# Altium schematic sheet 03_CONNECTORS_V1-0.SchDoc: RPi GS CAM SER.
size A3; Date: 2023-05-29; Author: M. Weimann; Organization: Altium Limited; Revision: 1.0; SheetNumber: 4; SheetTotal: 5; Title_Subtitle: Connectors; Language: DE; Department: F&E; Filename: RPi-GS-CAM-SER_PCB_V1-0.PDF; Project: PI-0017; DocType: Stromlauf; ItemNo-PCB: n/a
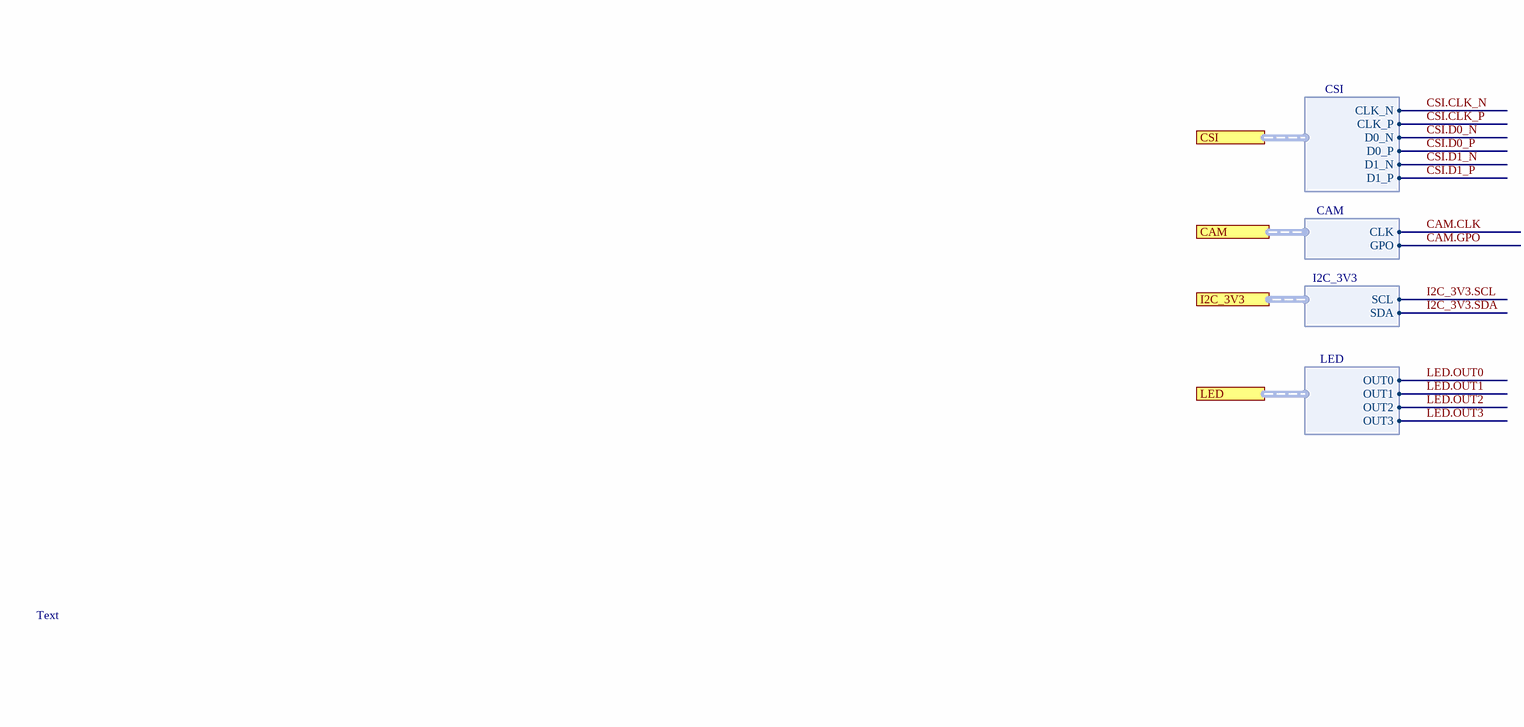
[diagram p0: 03_CONNECTORS_V1-0.SchDoc, left]
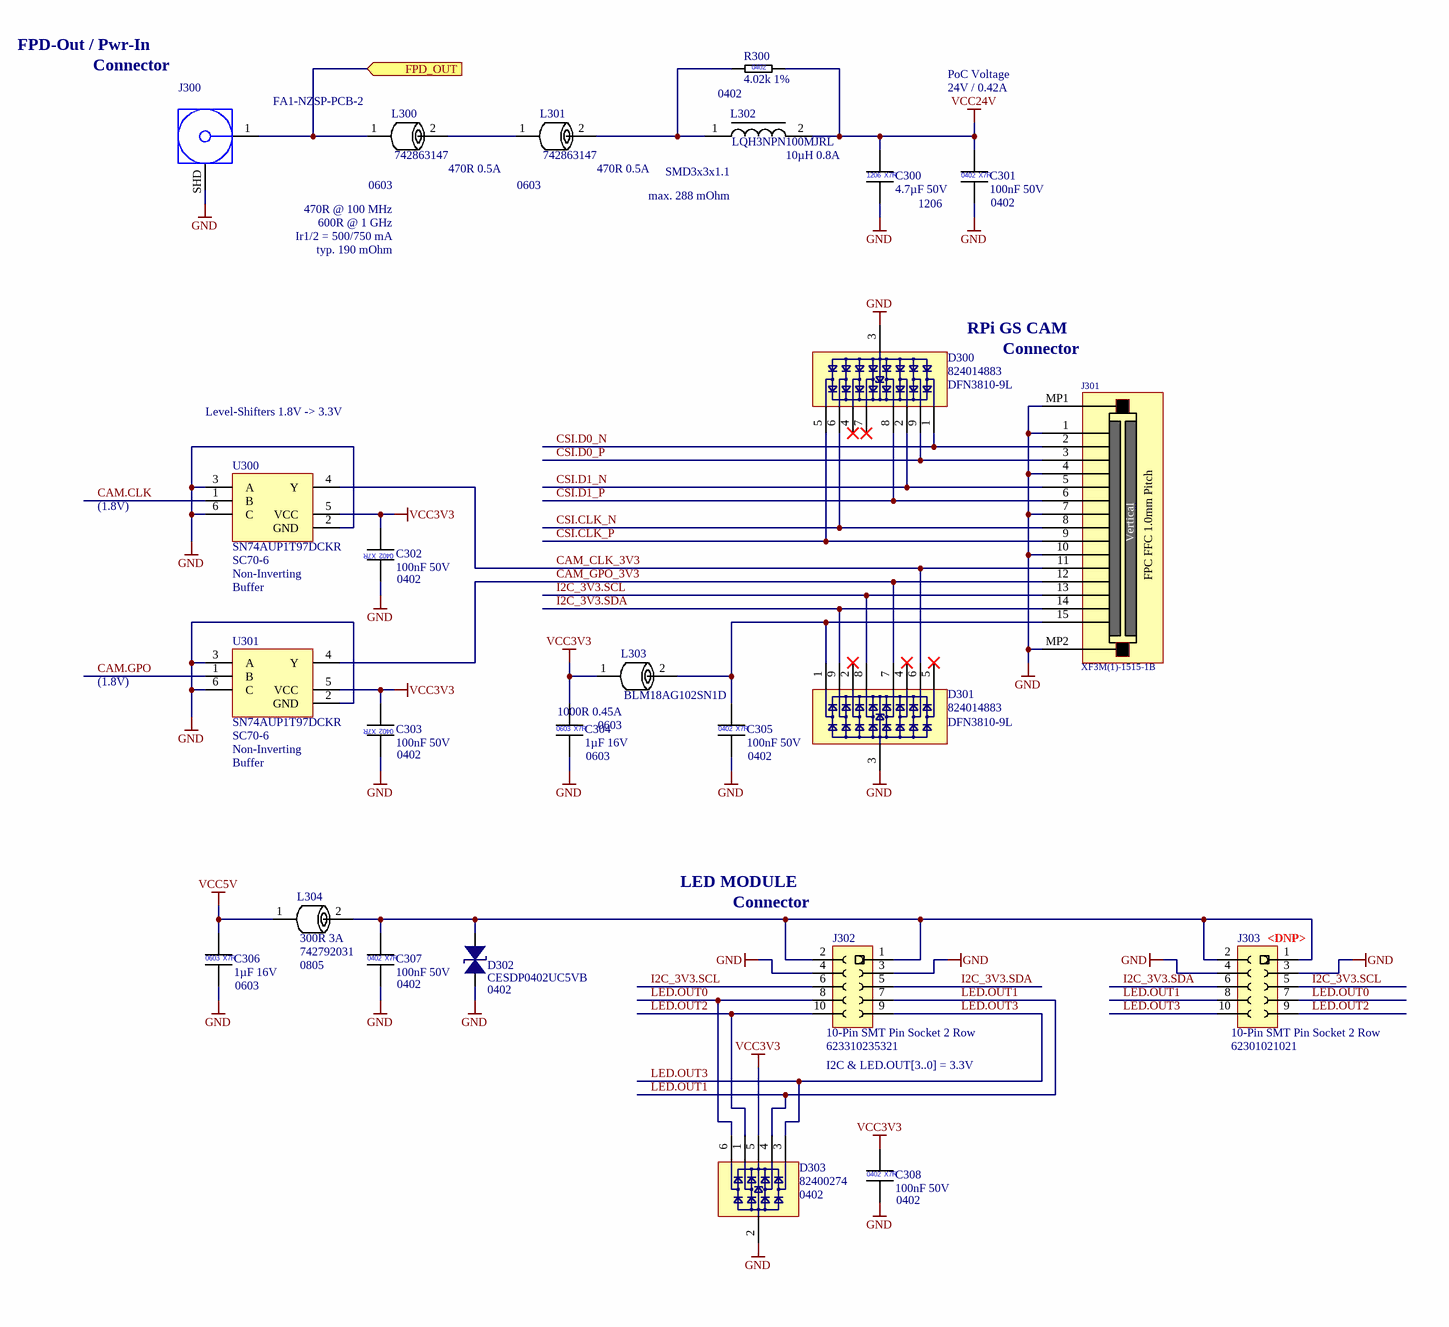
[diagram p1: 03_CONNECTORS_V1-0.SchDoc, right]

## Parts
C300  4.7µF 50V  [CAP_1206]
C301  100nF 50V  [CAP_0402_L]
C302  100nF 50V  [CAP_0402_L]
C303  100nF 50V  [CAP_0402_L]
C304  1µF 16V  [CAP_0603_L]
C305  100nF 50V  [CAP_0402_L]
C306  1µF 16V  [CAP_0603_L]
C307  100nF 50V  [CAP_0402_L]
C308  100nF 50V  [CAP_0402_L]
D300  824014883  [WE-TVS-DFN3810-9L]
D301  824014883  [WE-TVS-DFN3810-9L]
D302  CESDP0402UC5VB  [TVS_0402]  (value not drawn)
D303  82400274  [SOT65P210X100-6N]
J300  FA1-NZSP-PCB-2  [FA1-NZSP-PCB-2]  (value not drawn)
J301  XF3M(1)-1515-1B  [XF3M(1)-1515-1B]
J302  10-Pin SMT Pin Socket 2 Row  [623310235321]
J303  10-Pin SMT Pin Socket 2 Row  [62301021021]  (no BOM)
L300  742863147  [L_0603]
L301  742863147  [L_0603]
L302  LQH3NPN100MJRL  [LQH3NPN100MJRL]
L303  BLM18AG102SN1D  [L_0603]
L304  742792031  [L_0805]
R300  4.02k 1%  [RES_0402_L]
U300  SN74AUP1T97DCKR  [SOT65P210X100-6N]
U301  SN74AUP1T97DCKR  [SOT65P210X100-6N]

## Ports
CAM (harness CAM, see 00_RPi-GS-CAM-SER_V1-0[5B], 01_SERIALIZER_V1-0[7A]), CSI (harness CSI, see 00_RPi-GS-CAM-SER_V1-0[5B], 01_SERIALIZER_V1-0[7A]), FPD_OUT (in, see 00_RPi-GS-CAM-SER_V1-0[5B], 01_SERIALIZER_V1-0[7B]), I2C_3V3 (harness I2C_3V3, see 00_RPi-GS-CAM-SER_V1-0[5B], 02_I2C_V1-0[6A]), LED (harness LED, see 00_RPi-GS-CAM-SER_V1-0[5B], 02_I2C_V1-0[7C])

## Harnesses
I2C_3V3: SCL, SDA
LED: OUT0, OUT1, OUT2, OUT3
CSI: CLK_N, CLK_P, D0_N, D0_P, D1_P, D1_N
CAM: CLK, GPO

## Nets
GND: C300.2 C301.2 C302.1 C303.1 C304.2 C305.2 C306.2 C307.2 C308.2 D300.3(GND) D301.3(GND) D302.2 D303.2(GND) J300.SHD J301.1 J301.4 J301.7 J301.10 J301.MP1 J301.MP2 J302.3 J302.4 J303.3 J303.4 U300.2(GND) U300.3(A) U300.6(C) U301.2(GND) U301.3(A) U301.6(C)
VCC3V3: C302.2 C303.2 C304.1 C308.1 D303.5(VDD) L303.1 U300.5(VCC) U301.5(VCC)
VCC5V: C306.1 L304.1
VCC24V: C300.1 C301.1 L302.2 R300.2
CAM.CLK: U300.1(B) ; port CAM.CLK
CAM.GPO: U301.1(B) ; port CAM.GPO
CAM_CLK_3V3: D301.6(IO5) J301.11 U300.4(Y)
CAM_GPO_3V3: D301.7(IO6) J301.12 U301.4(Y)
CSI.CLK_N: D300.6(IO5) J301.8 ; port CSI.CLK_N
CSI.CLK_P: D300.5(IO4) J301.9 ; port CSI.CLK_P
CSI.D0_N: D300.1(IO1) J301.2 ; port CSI.D0_N
CSI.D0_P: D300.9(IO8) J301.3 ; port CSI.D0_P
CSI.D1_N: D300.2(IO2) J301.5 ; port CSI.D1_N
CSI.D1_P: D300.8(IO7) J301.6 ; port CSI.D1_P
FPD_OUT: J300.1(Signal) L300.1 ; port FPD_OUT
I2C_3V3.SCL: D301.8(IO7) J301.13 J302.6 J303.5 ; port I2C_3V3.SCL
I2C_3V3.SDA: D301.9(IO8) J301.14 J302.5 J303.6 ; port I2C_3V3.SDA
LED.OUT0: D303.6(IO4) J302.8 J303.7 ; port LED.OUT0
LED.OUT1: D303.4(IO3) J302.7 J303.8 ; port LED.OUT1
LED.OUT2: D303.1(IO1) J302.10 J303.9 ; port LED.OUT2
LED.OUT3: D303.3(IO2) J302.9 J303.10 ; port LED.OUT3
NetC305_1: C305.1 D301.1(IO1) J301.15 L303.2
NetC307_1: C307.1 D302.1 J302.1 J302.2 J303.1 J303.2 L304.2
NetL300_2: L300.2 L301.1
NetL301_2: L301.2 L302.1 R300.1

Not connected (* = marked no-connect by the designer): D300 4(IO3)* 7(IO6)*; D301 2(IO2)* 4(IO3)* 5(IO4)*

## Notes on the sheet
- FPD-Out / Pwr-In
- Connector
- (near R300) 0402
- PoC Voltage
- (near J300) FA1-NZSP-PCB-2
- 24V / 0.42A
- (near L300) 0603
- 470R @ 100 MHz
- (near L300) 470R 0.5A
- (near L301) 0603
- (near L301) 470R 0.5A
- (near L302) SMD3x3x1.1
- max. 288 mOhm
- (near L302) 10µH 0.8A
- (near C300) 1206
- (near C301) 0402
- Ir1/2 = 500/750 mA
- 600R @ 1 GHz
- typ. 190 mOhm
- RPi GS CAM
- Level-Shifters 1.8V -> 3.3V
- (near D300) DFN3810-9L
- (near J301) Connector
- (1.8V)
- (near U300) SC70-6
- (near U300) Non-Inverting
- Buffer
- (near C302) 0402
- (near U301) SC70-6
- (near U301) Non-Inverting
- (near C303) 0402
- 0603
- 1000R 0.45A
- (near D301) DFN3810-9L
- (near C304) 0603
- (near C305) 0402
- LED MODULE
- (near L304) 300R 3A
- (near J302) Connector
- (near J303) <DNP>
- Text
- (near C306) 0603
- 0805
- (near C307) 0402
- (near D302) CESDP0402UC5VB
- (near D302) 0402
- (near J302) 623310235321
- (near J302) I2C & LED.OUT[3..0] = 3.3V
- (near J303) 62301021021
- (near D303) 0402
- (near C308) 0402
- Erstellt von
- Dateiname
- ++CONFIDENTIAL++
- PCB Arts GmbH
- Dokumententyp
- Artikel-Nummer (PCB)
- Kurgartenstraße 59
- 90762 Fürth
- Elektronik- und Softwareentwicklung
- Titel, Sub-Titel
- Projekt
- Rev.
- Datum
- Sprache
- Seite
- The  information  contained  in  these  documents  is  confidential,  privileged  and  only  for  the
  information of the intended recipient and may
  not be used, published or redistributed without
  the prior written consent from PCB Arts GmbH.
- https://pcb-arts.com/
- mail@pcb-arts.com
- (in symbol CAP_0402_100nF_50V) 0402; X7R
- (in symbol CAP_0603_1µF_16V_X7R_10%) 0603; X7R
- (in symbol CAP_1206_4.7µF_50V_X7R_10%) 1206; X7R
- (in symbol RES_0402_4.02k_1%) 0402
- (in symbol XF3M(1)-1515-1B_15Pol FFC FPC Connector SMD) Vertical; FPC FFC 1.0mm Pitch

## Library data of the parts
C300 = CAP_1206_4.7µF_50V_X7R_10%: Multilayer Ceramic Capacitors MLCC - SMD/SMT 4.7 uF 50 VDC 10% 1206 X7R; Manufacturer 1: Murata Electronics; Manufacturer 1 Prt. Nr.: GRM31CR71H475KA12L; Manufacturer 2 Prt. Nr.: C1206X475K5RACAUTO; Manufacturer 2: Kemet
C301-C303 C305 C307 C308 = CAP_0402_100nF_50V: Multilayer Ceramic Capacitors MLCC - SMD/SMT 0402 50VDC; Manufacturer 1: Murata Electronics; Manufacturer 1 Prt. Nr.: GCM155L8EH104KE07D; Manufacturer 2 Prt. Nr.: UMK105B7104KV-FR; Manufacturer 2: TDK
C304 C306 = CAP_0603_1µF_16V_X7R_10%: Multilayer Ceramic Capacitors MLCC - SMD/SMT 0603 16VDC 1uF 10% X7R 0.8mm; Manufacturer 1: TDK; Manufacturer 1 Prt. Nr.: C1608X7R1C105K080AC; Manufacturer 2 Prt. Nr.: C0603C105K4RACTU; Manufacturer 2: KEMET
D300 D301 = 824014883_ESD-Suppressors_TVS-Diodes_3.3V_0.5pF_8Chnl: ESD Suppressors / TVS Diodes WE-TVS Diode Array 3.3V 0.5pF 8Channel; Manufacturer 1: Wurth Elektronik; Manufacturer 1 Prt. Nr.: 824014883
D302 = CESDP0402UC5VB_TVS Diode 0402: Low Capacitance ESD Protection Diode 0402; Manufacturer 1: CREATEK; Manufacturer 2 Prt. Nr.: BPESD0402-05ST; Manufacturer 1 Prt. Nr.: CESDP0402UC5VB; Manufacturer 2: BORN
D303 = 82400274_ESD-Suppressors_TVS-Diodes_5V_1.2pF_4Chnl: ESD Suppressors / TVS Diodes WE-TVS High Speed 5uA 5VDC 4+1; Manufacturer 1: Wurth Elektronik; Manufacturer 1 Prt. Nr.: 82400274
J300 = FA1-NZSP-PCB-2_FAKRA Key-Z Connector: FAKRA GEN 1 PCB Through Hole Straight Plug 50 Ohm Z Key Code; Manufacturer 1: Amphenol RF; Manufacturer 1 Prt. Nr.: FA1-NZSP-PCB-2
J301 = XF3M(1)-1515-1B_15Pol FFC FPC Connector SMD: 1.00mm Pitch RotaryBackLock FFC/FPC Connector, Surface Mount, Right-Angle,, Dual-Sided Contact Style, 15 Circuits; Manufacturer 1: Omron; Manufacturer 1 Prt. Nr.: XF3M(1)-1515-1B
J302 = 623310235321_WR-PHD_1.27mm_10Pin_SMT_Pin_Socket_2_Row_BottomEntry: Headers & Wire Housings WR-PHD 1.27mm SMT St SMT 10P 2Row H=2.2mm; Manufacturer 1: Wurth Elektronik; Manufacturer 1 Prt. Nr.: 623310235321
J303 = 62301021021_WR-PHD_1.27mm_10Pin_SMT_Pin_Socket_2_Row_TopEntry: Headers & Wire Housings WR-PHD 1.27 mm Dual SMT Socket Header H= 4.6mm; Manufacturer 1: Wurth Elektronik; Manufacturer 1 Prt. Nr.: 62301021021
L300 L301 = 742863147_Ferrite_Beads_0603_470Ohms_500mA: Ferrite Beads WE-CBF HF 0603 SMD 100MHz 470Ohm 500mA; Manufacturer 1: Wurth Elektronik; Manufacturer 1 Prt. Nr.: 742863147
L302 = 10uH 0.8A 240mΩ  LQH3NPN100MJRL: 10uH ±20% 0.8A 240mΩ SMD,3.0x3.0x1.1mm Chip Inductor; Manufacturer 1: Murata Electronics; Manufacturer 1 Prt. Nr.: LQH3NPN100MJRL
L303 = BLM18AG102SN1D_Ferrite Beads 0603 1000Ohms 450mA: Ferrite Beads BLM18 1000Ohms 450mA 0,5Ohm; Manufacturer 1: Murata Electronics; Manufacturer 1 Prt. Nr.: BLM18AG102SN1D
L304 = 742792031 _Ferrite_Beads_0805_300Ohms_3000mA: Ferrite Beads WE-CBF 0805 200MHz 300Ohm 3000mA AEC-Q200; Manufacturer 1: Wurth Elektronik; Manufacturer 1 Prt. Nr.: 742792031
R300 = RES_0402_4.02k_1%: Thick Film Resistors - SMD 4.02kOhm 1%; Manufacturer 1: Vishay / Dale; Manufacturer 1 Prt. Nr.: CRCW04024K02FKEDC; Manufacturer 2 Prt. Nr.: RC0402FR-134K02L; Manufacturer 2: Yageo
U300 U301 = SN74AUP1T97DCKR _SingleSupp_Vlt-Lvl_Transl_9-Conf-Logic-Gates: Translation - Single-Supply Voltage-level Translator / With Nine Configurable Gate Logic Functions; Manufacturer 1: Texas Instruments; Manufacturer 1 Prt. Nr.: SN74AUP1T97DCKR